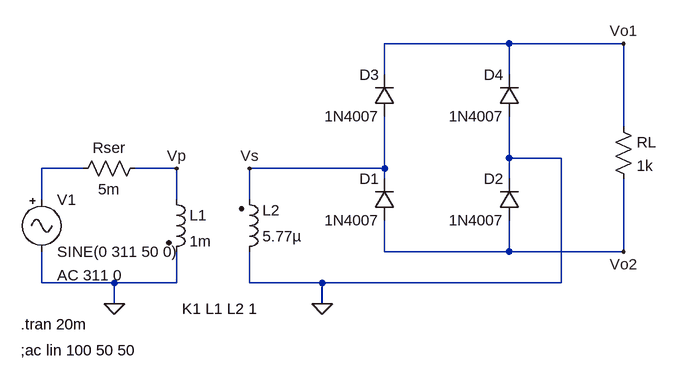
[diagram p0: schematic 3_12_pablo_gomez_tp4_ej2.asc]
3_12_pablo_gomez_tp4_ej2.asc, the LTspice schematic file:
Version 4
SHEET 1 880 680
WIRE 592 -128 400 -128
WIRE 768 -128 592 -128
WIRE 400 -80 400 -128
WIRE 592 -80 592 -128
WIRE 768 0 768 -128
WIRE 592 48 592 -16
WIRE 672 48 592 48
WIRE -64 64 -128 64
WIRE 80 64 16 64
WIRE 400 64 400 -16
WIRE 400 64 192 64
WIRE 400 80 400 64
WIRE 592 80 592 48
WIRE -128 112 -128 64
WIRE 80 112 80 64
WIRE 192 112 192 64
WIRE 400 192 400 144
WIRE 592 192 592 144
WIRE 592 192 400 192
WIRE 768 192 768 80
WIRE 768 192 592 192
WIRE -128 240 -128 192
WIRE -16 240 -128 240
WIRE 80 240 80 192
WIRE 80 240 -16 240
WIRE 192 240 192 192
WIRE 304 240 192 240
WIRE 672 240 672 48
WIRE 672 240 304 240
WIRE -16 272 -16 240
WIRE 304 272 304 240
FLAG -16 272 0
FLAG 304 272 0
FLAG 80 64 Vp
FLAG 192 64 Vs
FLAG 768 -128 Vo1
FLAG 768 192 Vo2
SYMBOL ind2 64 96 R0
SYMATTR InstName L1
SYMATTR Value 1m
SYMATTR Type ind
SYMBOL ind2 176 208 M180
WINDOW 0 36 80 Left 2
WINDOW 3 36 40 Left 2
SYMATTR InstName L2
SYMATTR Value 5.77µ
SYMATTR Type ind
SYMBOL Misc\\signal -128 96 R0
WINDOW 123 24 132 Left 2
WINDOW 39 0 0 Left 0
SYMATTR Value2 AC 311 0
SYMATTR InstName V1
SYMATTR Value SINE(0 311 50 0)
SYMBOL res 32 48 R90
WINDOW 0 0 56 VBottom 2
WINDOW 3 32 56 VTop 2
SYMATTR InstName Rser
SYMATTR Value 5m
SYMBOL diode 608 144 R180
WINDOW 0 24 64 Left 2
WINDOW 3 24 0 Left 2
SYMATTR InstName D2
SYMATTR Value 1N4007
SYMBOL diode 416 -16 R180
WINDOW 0 24 64 Left 2
WINDOW 3 24 0 Left 2
SYMATTR InstName D3
SYMATTR Value 1N4007
SYMBOL diode 608 -16 R180
WINDOW 0 24 64 Left 2
WINDOW 3 24 0 Left 2
SYMATTR InstName D4
SYMATTR Value 1N4007
SYMBOL res 752 -16 R0
SYMATTR InstName RL
SYMATTR Value 1k
SYMBOL diode 416 144 R180
WINDOW 0 24 64 Left 2
WINDOW 3 24 0 Left 2
SYMATTR InstName D1
SYMATTR Value 1N4007
TEXT 88 280 Left 2 !K1 L1 L2 1
TEXT -160 304 Left 2 !.tran 20m
TEXT -160 344 Left 2 !;ac lin 100 50 50

The netlist it stands for:
* 3_12_pablo_gomez_tp4_ej2.asc
L1 Vp 0 1m
L2 0 Vs 5.77µ
V1 N001 0 SINE(0 311 50 0) AC 311 0
Rser Vp N001 5m
D2 Vo2 0 1N4007
D3 Vs Vo1 1N4007
D4 0 Vo1 1N4007
RL Vo1 Vo2 1k
D1 Vo2 Vs 1N4007
.model D D
.lib standard.dio
K1 L1 L2 1
.tran 20m
;ac lin 100 50 50
.backanno
.end